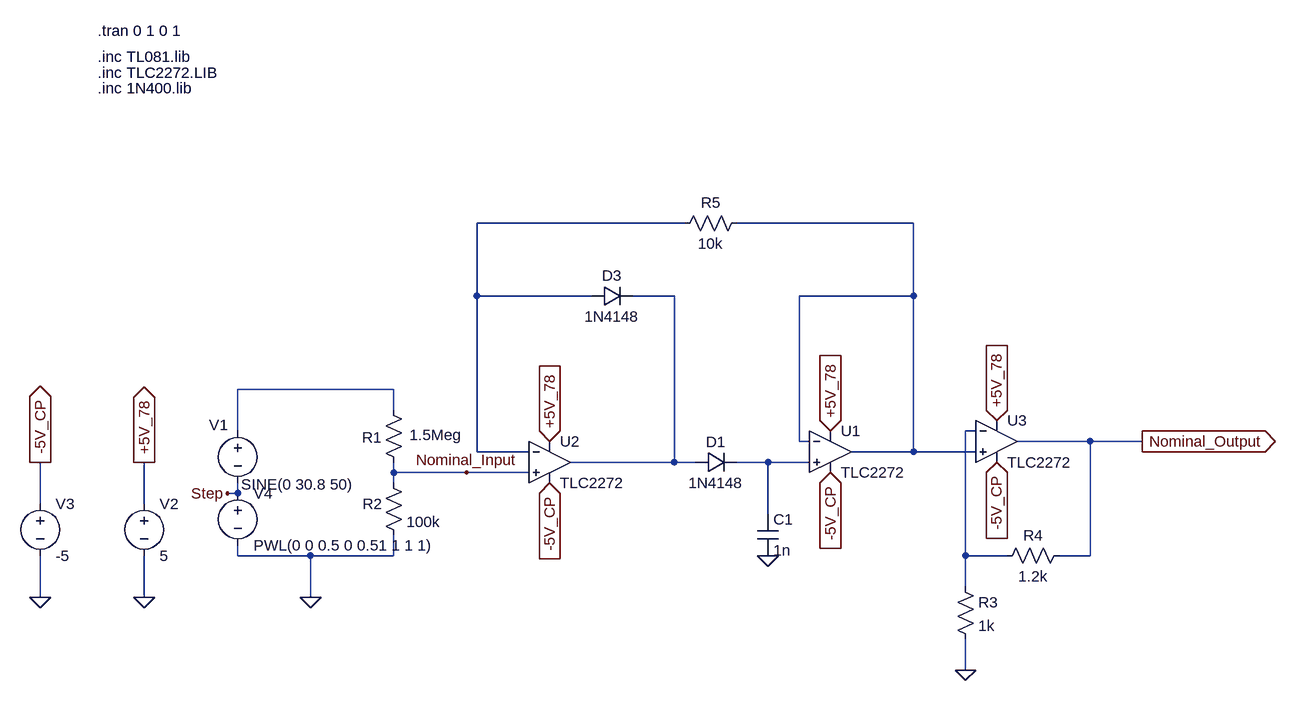
[diagram p0: schematic Voltage shifter and peak detector.asc]
Voltage shifter and peak detector.asc, the LTspice schematic file:
Version 4
SHEET 1 2276 1956
WIRE -2048 -192 -2368 -192
WIRE -1696 -192 -1968 -192
WIRE -2368 -80 -2368 -192
WIRE -2192 -80 -2368 -80
WIRE -2064 -80 -2128 -80
WIRE -1696 -80 -1696 -192
WIRE -1696 -80 -1872 -80
WIRE -2496 64 -2736 64
WIRE -2496 96 -2496 64
WIRE -2736 128 -2736 64
WIRE -1600 128 -1616 128
WIRE -1872 144 -1872 -80
WIRE -1856 144 -1872 144
WIRE -1424 144 -1536 144
WIRE -1344 144 -1424 144
WIRE -2368 160 -2368 -80
WIRE -2288 160 -2368 160
WIRE -1696 160 -1696 -80
WIRE -1696 160 -1792 160
WIRE -1600 160 -1696 160
WIRE -2064 176 -2064 -80
WIRE -2064 176 -2224 176
WIRE -2032 176 -2064 176
WIRE -1920 176 -1968 176
WIRE -1856 176 -1920 176
WIRE -2496 192 -2496 176
WIRE -2384 192 -2496 192
WIRE -2288 192 -2384 192
WIRE -2496 208 -2496 192
WIRE -2736 224 -2736 208
WIRE -2736 224 -2752 224
WIRE -3040 240 -3040 176
WIRE -2880 240 -2880 176
WIRE -1920 256 -1920 176
WIRE -2736 320 -2736 304
WIRE -2624 320 -2736 320
WIRE -2496 320 -2496 288
WIRE -2496 320 -2624 320
WIRE -1616 320 -1616 128
WIRE -1552 320 -1616 320
WIRE -1424 320 -1424 144
WIRE -1424 320 -1472 320
WIRE -1616 368 -1616 320
WIRE -3040 384 -3040 320
WIRE -2880 384 -2880 320
WIRE -2624 384 -2624 320
WIRE -1616 496 -1616 448
FLAG -2624 384 0
FLAG -2880 384 0
FLAG -2880 176 +5V_78
IOPIN -2880 176 Out
FLAG -1824 128 +5V_78
IOPIN -1824 128 In
FLAG -2256 144 +5V_78
IOPIN -2256 144 In
FLAG -2256 208 -5V_CP
IOPIN -2256 208 In
FLAG -3040 384 0
FLAG -3040 176 -5V_CP
IOPIN -3040 176 Out
FLAG -1824 192 -5V_CP
IOPIN -1824 192 In
FLAG -1920 320 0
FLAG -1568 112 +5V_78
IOPIN -1568 112 In
FLAG -1568 176 -5V_CP
IOPIN -1568 176 In
FLAG -1616 496 0
FLAG -1344 144 Nominal_Output
IOPIN -1344 144 Out
FLAG -2752 224 Step
FLAG -2384 192 Nominal_Input
SYMBOL voltage -2736 112 R0
WINDOW 123 0 0 Left 2
WINDOW 39 0 0 Left 2
WINDOW 0 -44 7 Left 2
WINDOW 3 5 98 Left 2
SYMATTR InstName V1
SYMATTR Value SINE(0 30.8 50)
SYMBOL res -2512 80 R0
WINDOW 0 -33 58 Left 2
WINDOW 3 40 54 Left 2
SYMATTR InstName R1
SYMATTR Value 1.5Meg
SYMBOL res -2512 192 R0
WINDOW 0 -32 48 Left 2
SYMATTR InstName R2
SYMATTR Value 100k
SYMBOL voltage -2880 224 R0
WINDOW 123 0 0 Left 0
WINDOW 39 0 0 Left 0
SYMATTR InstName V2
SYMATTR Value 5
SYMBOL Opamps\\opamp2 -1824 96 R0
SYMATTR InstName U1
SYMATTR Value TLC2272
SYMBOL Opamps\\opamp2 -2256 112 R0
SYMATTR InstName U2
SYMATTR Value TLC2272
SYMBOL diode -2192 -64 R270
WINDOW 0 32 32 VTop 2
WINDOW 3 0 32 VBottom 2
SYMATTR InstName D3
SYMATTR Value 1N4148
SYMBOL voltage -3040 224 R0
WINDOW 123 0 0 Left 0
WINDOW 39 0 0 Left 0
SYMATTR InstName V3
SYMATTR Value -5
SYMBOL res -1952 -208 R90
WINDOW 0 0 56 VBottom 2
WINDOW 3 32 56 VTop 2
SYMATTR InstName R5
SYMATTR Value 10k
SYMBOL diode -2032 192 R270
WINDOW 0 32 32 VTop 2
WINDOW 3 0 32 VBottom 2
SYMATTR InstName D1
SYMATTR Value 1N4148
SYMBOL cap -1936 256 R0
SYMATTR InstName C1
SYMATTR Value 1n
SYMBOL Opamps\\opamp2 -1568 80 R0
SYMATTR InstName U3
SYMATTR Value TLC2272
SYMBOL res -1632 352 R0
SYMATTR InstName R3
SYMATTR Value 1k
SYMBOL res -1456 304 R90
WINDOW 0 0 56 VBottom 2
WINDOW 3 32 56 VTop 2
SYMATTR InstName R4
SYMATTR Value 1.2k
SYMBOL voltage -2736 208 R0
WINDOW 123 0 0 Left 0
WINDOW 39 0 0 Left 0
SYMATTR InstName V4
SYMATTR Value PWL(0 0 0.5 0 0.51 1 1 1)
TEXT -2952 -448 Left 2 !.inc TL081.lib
TEXT -2952 -424 Left 2 !.inc TLC2272.LIB
TEXT -2952 -488 Left 2 !.tran 0 1 0 1
TEXT -2952 -400 Left 2 !.inc 1N400.lib

The netlist it stands for:
* Voltage shifter and peak detector.asc
V1 N004 Step SINE(0 30.8 50)
R1 N004 Nominal_Input 1.5Meg
R2 Nominal_Input 0 100k
V2 +5V_78 0 5
XU1 N006 N002 +5V_78 -5V_CP N002 TLC2272  ; pins In+ In- V+ V- OUT
XU2 Nominal_Input N001 +5V_78 -5V_CP N003 TLC2272  ; pins In+ In- V+ V- OUT
D3 N001 N003 1N4148
V3 -5V_CP 0 -5
R5 N002 N001 10k
D1 N003 N006 1N4148
C1 N006 0 1n
XU3 N002 N005 +5V_78 -5V_CP Nominal_Output TLC2272  ; pins In+ In- V+ V- OUT
R3 N005 0 1k
R4 Nominal_Output N005 1.2k
V4 Step 0 PWL(0 0 0.5 0 0.51 1 1 1)
.model D D
.lib standard.dio
.inc TL081.lib
.inc TLC2272.LIB
.tran 0 1 0 1
.inc 1N400.lib
.backanno
.end